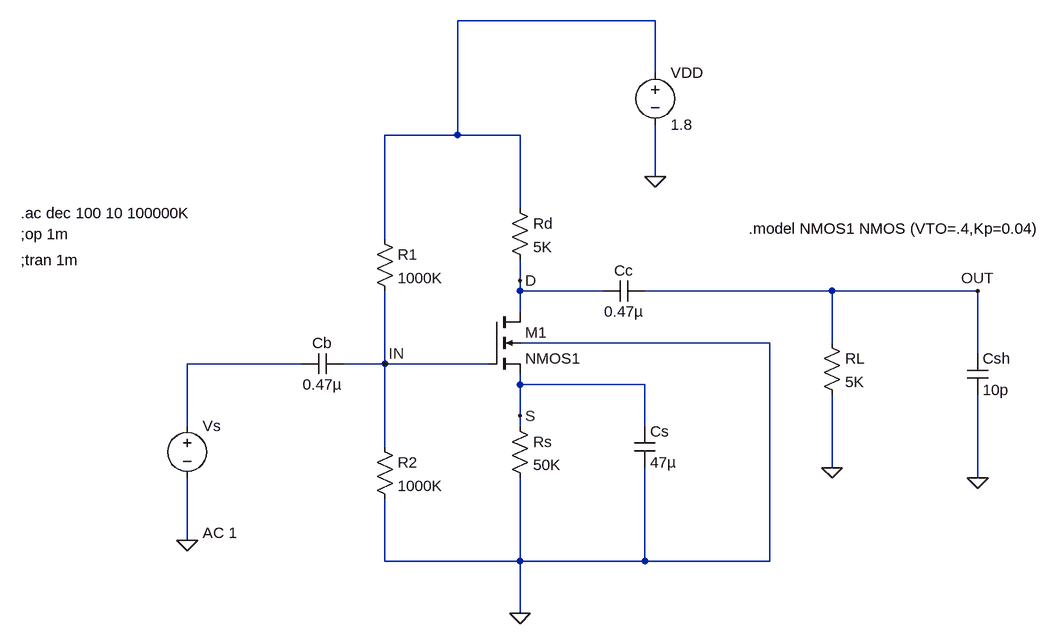
[diagram p0: schematic cs_amp_res_load.asc]
cs_amp_res_load.asc, the LTspice schematic file:
Version 4
SHEET 1 1152 680
WIRE 448 -368 144 -368
WIRE 448 -288 448 -368
WIRE 144 -192 144 -368
WIRE 144 -192 32 -192
WIRE 240 -192 144 -192
WIRE 448 -128 448 -208
WIRE 240 -80 240 -192
WIRE 32 -32 32 -192
WIRE 240 32 240 0
WIRE 240 48 240 32
WIRE 368 48 240 48
WIRE 720 48 432 48
WIRE 944 48 720 48
WIRE 240 80 240 48
WIRE 624 128 240 128
WIRE 720 128 720 48
WIRE 944 144 944 48
WIRE -96 160 -272 160
WIRE 32 160 32 48
WIRE 32 160 -32 160
WIRE 192 160 32 160
WIRE 240 192 240 176
WIRE 432 192 240 192
WIRE 240 240 240 192
WIRE -272 256 -272 160
WIRE 240 256 240 240
WIRE 432 256 432 192
WIRE 32 288 32 160
WIRE 720 320 720 208
WIRE 944 336 944 208
WIRE -272 432 -272 336
WIRE 32 464 32 368
WIRE 240 464 240 336
WIRE 240 464 32 464
WIRE 432 464 432 320
WIRE 432 464 240 464
WIRE 624 464 624 128
WIRE 624 464 432 464
WIRE 240 544 240 464
FLAG -272 432 0
FLAG 720 320 0
FLAG 944 336 0
FLAG 448 -128 0
FLAG 240 544 0
FLAG 32 160 IN
FLAG 944 48 OUT
FLAG 240 32 D
FLAG 240 240 S
SYMBOL res 224 240 R0
SYMATTR InstName Rs
SYMATTR Value 50K
SYMBOL res 224 -96 R0
SYMATTR InstName Rd
SYMATTR Value 5K
SYMBOL cap 416 256 R0
SYMATTR InstName Cs
SYMATTR Value 47µ
SYMBOL res 16 -48 R0
SYMATTR InstName R1
SYMATTR Value 1000K
SYMBOL res 16 272 R0
SYMATTR InstName R2
SYMATTR Value 1000K
SYMBOL cap 432 32 R90
WINDOW 0 0 32 VBottom 2
WINDOW 3 32 32 VTop 2
SYMATTR InstName Cc
SYMATTR Value 0.47µ
SYMBOL cap -32 144 R90
WINDOW 0 0 32 VBottom 2
WINDOW 3 32 32 VTop 2
SYMATTR InstName Cb
SYMATTR Value 0.47µ
SYMBOL res 704 112 R0
SYMATTR InstName RL
SYMATTR Value 5K
SYMBOL cap 928 144 R0
SYMATTR InstName Csh
SYMATTR Value 10p
SYMBOL voltage 448 -304 R0
SYMATTR InstName VDD
SYMATTR Value 1.8
SYMBOL voltage -272 240 R0
WINDOW 3 24 152 Left 2
WINDOW 123 24 180 Left 2
WINDOW 39 0 0 Left 0
SYMATTR InstName Vs
SYMATTR Value ""
SYMATTR Value2 AC 1
SYMBOL nmos4 192 80 R0
SYMATTR InstName M1
SYMATTR Value NMOS1
SYMATTR Value2 l=180n w=2u
TEXT 592 -48 Left 2 !.model NMOS1 NMOS (VTO=.4,Kp=0.04)
TEXT -528 -40 Left 2 !;op 1m
TEXT -528 0 Left 2 !;tran 1m
TEXT -528 -72 Left 2 !.ac dec 100 10 100000K

The netlist it stands for:
* cs_amp_res_load.asc
Rs S 0 50K
Rd N001 D 5K
Cs S 0 47µ
R1 N001 IN 1000K
R2 IN 0 1000K
Cc OUT D 0.47µ
Cb IN N002 0.47µ
RL OUT 0 5K
Csh OUT 0 10p
VDD N001 0 1.8
Vs N002 0 AC 1
M1 D IN S 0 NMOS1 l=180n w=2u
.model NMOS NMOS
.model PMOS PMOS
.lib standard.mos
.model NMOS1 NMOS (VTO=.4,Kp=0.04)
;op 1m
;tran 1m
.ac dec 100 10 100000K
.backanno
.end